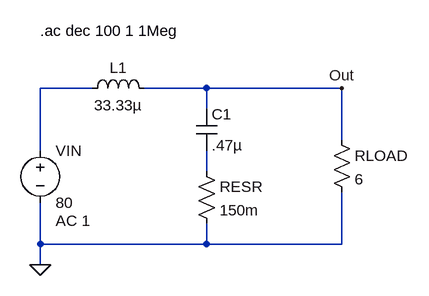
[diagram p0: schematic Draft2.asc]
Draft2.asc, the LTspice schematic file:
Version 4
SHEET 1 2176 1260
WIRE 576 -16 496 -16
WIRE 752 -16 656 -16
WIRE 960 -16 752 -16
WIRE 752 16 752 -16
WIRE 960 64 960 -16
WIRE 496 80 496 -16
WIRE 752 112 752 80
WIRE 496 224 496 160
WIRE 752 224 752 192
WIRE 752 224 496 224
WIRE 960 224 960 144
WIRE 960 224 752 224
WIRE 496 256 496 224
FLAG 496 256 0
FLAG 960 -16 Out
SYMBOL voltage 496 64 R0
WINDOW 123 24 124 Left 2
WINDOW 39 0 0 Left 0
SYMATTR Value2 AC 1
SYMATTR InstName VIN
SYMATTR Value 80
SYMBOL ind 560 0 R270
WINDOW 0 32 56 VTop 2
WINDOW 3 5 56 VBottom 2
SYMATTR InstName L1
SYMATTR Value 33.33µ
SYMBOL cap 736 16 R0
SYMATTR InstName C1
SYMATTR Value .47µ
SYMBOL res 944 48 R0
SYMATTR InstName RLOAD
SYMATTR Value 6
SYMBOL res 736 96 R0
SYMATTR InstName RESR
SYMATTR Value 150m
TEXT 496 -104 Left 2 !.ac dec 100 1 1Meg

The netlist it stands for:
* Draft2.asc
VIN N001 0 80 AC 1
L1 N001 Out 33.33µ
C1 Out N002 .47µ
RLOAD Out 0 6
RESR N002 0 150m
.ac dec 100 1 1Meg
.backanno
.end